# Altium schematic sheet Power_Supply.SchDoc
size A4
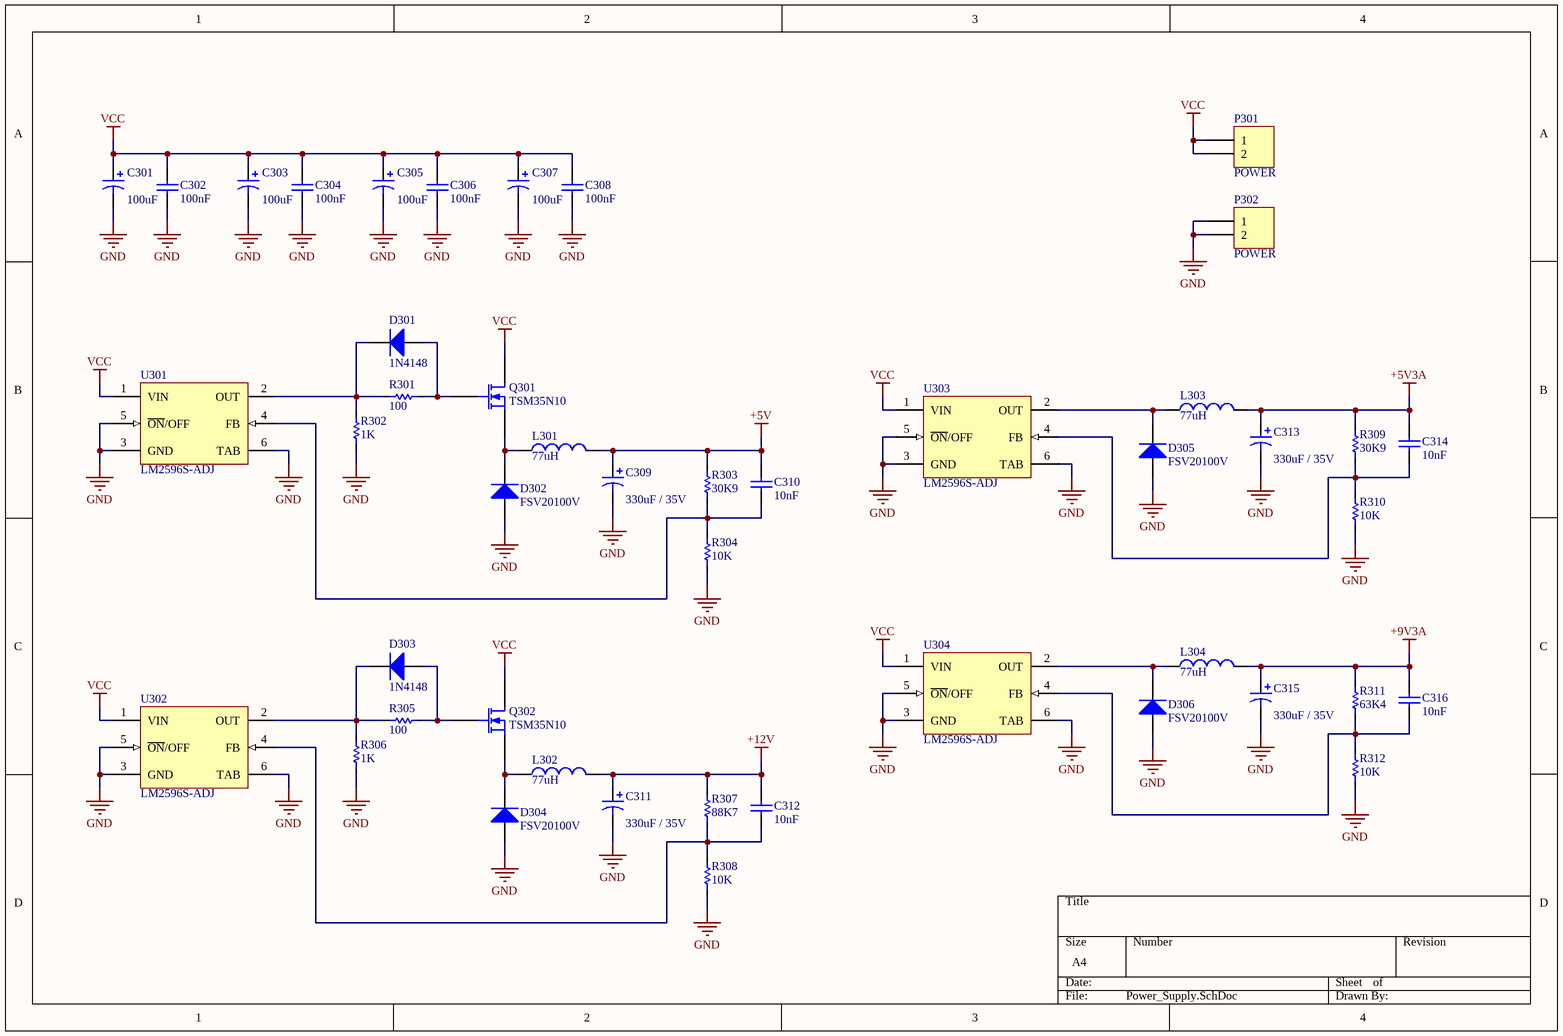
[diagram p0: Power_Supply.SchDoc]

## Parts
C301  value 100uF  [F55]  (hidden comment: Cap Pol3)
C302  VALOR: 100nF  [C0603]  (hidden comment: Cap Ceramico SMD)
C303  value 100uF  [F55]  (hidden comment: Cap Pol3)
C304  VALOR: 100nF  [C0603]  (hidden comment: Cap Ceramico SMD)
C305  value 100uF  [F55]  (hidden comment: Cap Pol3)
C306  VALOR: 100nF  [C0603]  (hidden comment: Cap Ceramico SMD)
C307  value 100uF  [F55]  (hidden comment: Cap Pol3)
C308  VALOR: 100nF  [C0603]  (hidden comment: Cap Ceramico SMD)
C309  value 330uF / 35V  [MCL1GS]  (hidden comment: Cap Pol3)
C310  VALOR: 10nF  [C0603]  (hidden comment: Cap Ceramico SMD)
C311  value 330uF / 35V  [MCL1GS]  (hidden comment: Cap Pol3)
C312  VALOR: 10nF  [C0603]  (hidden comment: Cap Ceramico SMD)
C313  value 330uF / 35V  [MCL1GS]  (hidden comment: Cap Pol3)
C314  VALOR: 10nF  [C0603]  (hidden comment: Cap Ceramico SMD)
C315  value 330uF / 35V  [MCL1GS]  (hidden comment: Cap Pol3)
C316  VALOR: 10nF  [C0603]  (hidden comment: Cap Ceramico SMD)
D301  VALOR: 1N4148  [SOD-80]  (hidden comment: Diodo Rectificador SMD)
D302  VALOR: FSV20100V  [TO-277-3]  (hidden comment: Diodo Rectificador SMD)
D303  VALOR: 1N4148  [SOD-80]  (hidden comment: Diodo Rectificador SMD)
D304  VALOR: FSV20100V  [TO-277-3]  (hidden comment: Diodo Rectificador SMD)
D305  VALOR: FSV20100V  [TO-277-3]  (hidden comment: Diodo Rectificador SMD)
D306  VALOR: FSV20100V  [TO-277-3]  (hidden comment: Diodo Rectificador SMD)
L301  value 77uH  [KM-3.0]  (hidden comment: Inductor)
L302  value 77uH  [KM-3.0]  (hidden comment: Inductor)
L303  value 77uH  [KM-3.0]  (hidden comment: Inductor)
L304  value 77uH  [KM-3.0]  (hidden comment: Inductor)
P301  POWER  [Terminal_2way_508]
P302  POWER  [Terminal_2way_508]
Q301  TSM35N10  [TO-252AA_A_M]
Q302  TSM35N10  [TO-252AA_A_M]
R301  VALOR: 100  [R0603]  (hidden comment: Res SMD)
R302  VALOR: 1K  [R0603]  (hidden comment: Res SMD)
R303  VALOR: 30K9  [R0603]  (hidden comment: Res SMD)
R304  VALOR: 10K  [R0603]  (hidden comment: Res SMD)
R305  VALOR: 100  [R0603]  (hidden comment: Res SMD)
R306  VALOR: 1K  [R0603]  (hidden comment: Res SMD)
R307  VALOR: 88K7  [R0603]  (hidden comment: Res SMD)
R308  VALOR: 10K  [R0603]  (hidden comment: Res SMD)
R309  VALOR: 30K9  [R0603]  (hidden comment: Res SMD)
R310  VALOR: 10K  [R0603]  (hidden comment: Res SMD)
R311  VALOR: 63K4  [R0603]  (hidden comment: Res SMD)
R312  VALOR: 10K  [R0603]  (hidden comment: Res SMD)
U301  LM2596S-ADJ  [TS5B_M]
U302  LM2596S-ADJ  [TS5B_M]
U303  LM2596S-ADJ  [TS5B_M]
U304  LM2596S-ADJ  [TS5B_M]

## Nets
+5V: C309.1 C310.1 L301.2 R303.1
+5V3A: C313.1 C314.1 L303.2 R309.1
+9V3A: C315.1 C316.1 L304.2 R311.1
+12V: C311.1 C312.1 L302.2 R307.1
GND: C301.2 C302.2 C303.2 C304.2 C305.2 C306.2 C307.2 C308.2 C309.2 C311.2 C313.2 C315.2 D302.1(A) D304.1(A) D305.1(A) D306.1(A) P302.1 P302.2 R302.2 R304.2 R306.2 R308.2 R310.2 R312.2 U301.3(GND) U301.5(~{ON}/OFF) U301.6(TAB) U302.3(GND) U302.5(~{ON}/OFF) U302.6(TAB) U303.3(GND) U303.5(~{ON}/OFF) U303.6(TAB) U304.3(GND) U304.5(~{ON}/OFF) U304.6(TAB)
VCC: C301.1 C302.1 C303.1 C304.1 C305.1 C306.1 C307.1 C308.1 P301.1 P301.2 Q301.4(D) Q302.4(D) U301.1(VIN) U302.1(VIN) U303.1(VIN) U304.1(VIN)
NetC310_2: C310.2 R303.2 R304.1 U301.4(FB)
NetC312_2: C312.2 R307.2 R308.1 U302.4(FB)
NetC314_2: C314.2 R309.2 R310.1 U303.4(FB)
NetC316_2: C316.2 R311.2 R312.1 U304.4(FB)
NetD301_1: D301.1(A) Q301.1(G) R301.1
NetD301_2: D301.2(K) R301.2 R302.1 U301.2(OUT)
NetD302_2: D302.2(K) L301.1 Q301.3(S)
NetD303_1: D303.1(A) Q302.1(G) R305.1
NetD303_2: D303.2(K) R305.2 R306.1 U302.2(OUT)
NetD304_2: D304.2(K) L302.1 Q302.3(S)
NetD305_2: D305.2(K) L303.1 U303.2(OUT)
NetD306_2: D306.2(K) L304.1 U304.2(OUT)

## Library data of the parts
C301 C303 C305 C307 C309 C311 C313 C315 = Cap Pol3: Polarized Capacitor (Surface Mount); Published: 8-Jun-2000; LatestRevisionDate: 29-May-2009; LatestRevisionNote: IPC-7351 Footprint Added.; PackageReference: C0805; Publisher: Altium Limited; PackageDescription: Chip Capacitor
  C301 C303 C305 C307: DigiKey: 493-2105-1-ND; Arrow: UWX1C101MCL1GB
  C309 C311 C313 C315: DigiKey: 493-2206-2-ND; Arrow: UWT1V331MNL1GS
C302 C304 C306 C308 C310 C312 C314 C316 = Cap Ceramico SMD: Cap Ceramico SMD 0805; CODIGO RUF: *; PROVEEDOR: *; FABRICANTE: *
  C302 C304 C306 C308: Arrow: C0603C104K5RACAUTO; Digikey: 399-6856-1-ND
  C310 C312 C314 C316: Arrow: 06035C103KAT4A; Digikey: 478-10055-1-ND
D301-D306 = Diodo Rectificador SMD: Diodo Rectificador; PROVEEDOR: *; CODIGO RUF: *; FABRIANTE: *
  D301 D303: Arrow: FDLL4148; Digikey: FDLL4148TR-ND
  D302 D304-D306: Arrow: FSV20100V; Digikey: FSV20100VCT-ND
L301-L304 = Inductor: Code_IEC: 1005; Published: 8-Jun-2000; LatestRevisionDate: 29-May-2009; LatestRevisionNote: IPC-7351 Footprint Added.; PackageReference: 0402-A; Publisher: Altium Limited; PackageDescription: Chip Inductor; Code_JEITA: 0402; DigiKey: 553-2112-ND; Arrow: PE-54044NL
P301 P302 = Header 2: Header, 2-Pin; LatestRevisionDate: 17-Jul-2002; LatestRevisionNote: Re-released for DXP Platform.; Publisher: Altium Limited; Arrow: TB007-508-02BE; Digikey: 102-6203-ND
Q301 Q302 = MOSFET-N: N-Channel MOSFET; Published: 8-Jun-2000; LatestRevisionDate: 17-Jul-2002; LatestRevisionNote: Re-released for DXP Platform.; PackageVersion: 1995/1996; PackageReference: E3; Publisher: Altium Limited; PackageDescription: TO, Flat Index; 3 In-Line, Axial Leads; Body Dia. 4.6mm; Lead Dia. 0.5 mm (max); Arrow: TSM35N10CP ROG; Digikey: TSM35N10CPROGTR-ND
U301-U304 = LM2596S-ADJ: SIMPLE SWITCHER® Power Converter 150 KHz 3A Step-Down Voltage Regulator, 5-pin TO-263; Manufacturer: National Semiconductor; PackageTopMarking: NSUZXYTTE#*LM2596S*-ADJ P+; PowerWise: N; Published: 4-Dec-2008; DatasheetVersion: May-2002; PackageVersion: revD, Apr-2005; PackageReference: TS5B; Publisher: Altium Limited; PackageDescription: TO-263, Molded, .400 x .390 x .180in, 5 Lead, .067in Pitch, Surface Mount; Supplier 1: Farnell; Supplier Part Number 1: 1523864; Supplier 2: Farnell; Supplier Part Number 2: 9494367; PartNumber: LM2596S-ADJ; RoHS: N; PinCount: 5; CompType: Switcher; Code_JEDEC: MO-169-AB; ComponentLink1Description: LM2596 Datasheet; ComponentLink1URL: http://www.national.com/ds/LM/LM2596.pdf; ComponentLink2Description: LM2596 Web Page; ComponentLink2URL: http://www.national.com/pf/LM/LM2596.html; ComponentLink3Description: TS5B Package Page; ComponentLink3URL: http://www.national.com/packaging/folders/ts5b.html; Arrow: LM2596DSADJR4G; Digikey: LM2596DSADJR4GOSCT-ND
R301-R312 = Res SMD: CODIGO RUF: *; PROVEEDOR: *; FABRICANTE: *
  R301 R305: Arrow: RC0603FR-07100RL; Digikey: 311-100HRCT-ND
  R302 R306: Arrow: RCA06031K00FKEA; Digikey: YAG2323CT-ND
  R303 R309: Arrow: CRCW060330K9FKEAHP; Digikey: 541-30.9KHCT-ND
  R304 R308 R310 R312: Arrow: MCT06030C1002FP500; Digikey: RMCF0603FT10K0CT-ND
  R307: Arrow: RMCF0603FT88K7; Digikey: 738-RMCF0603FT88K7CT-ND
  R311: Arrow: RMCF0603FT63K4; Digikey: RMCF0603FT63K4CT-ND